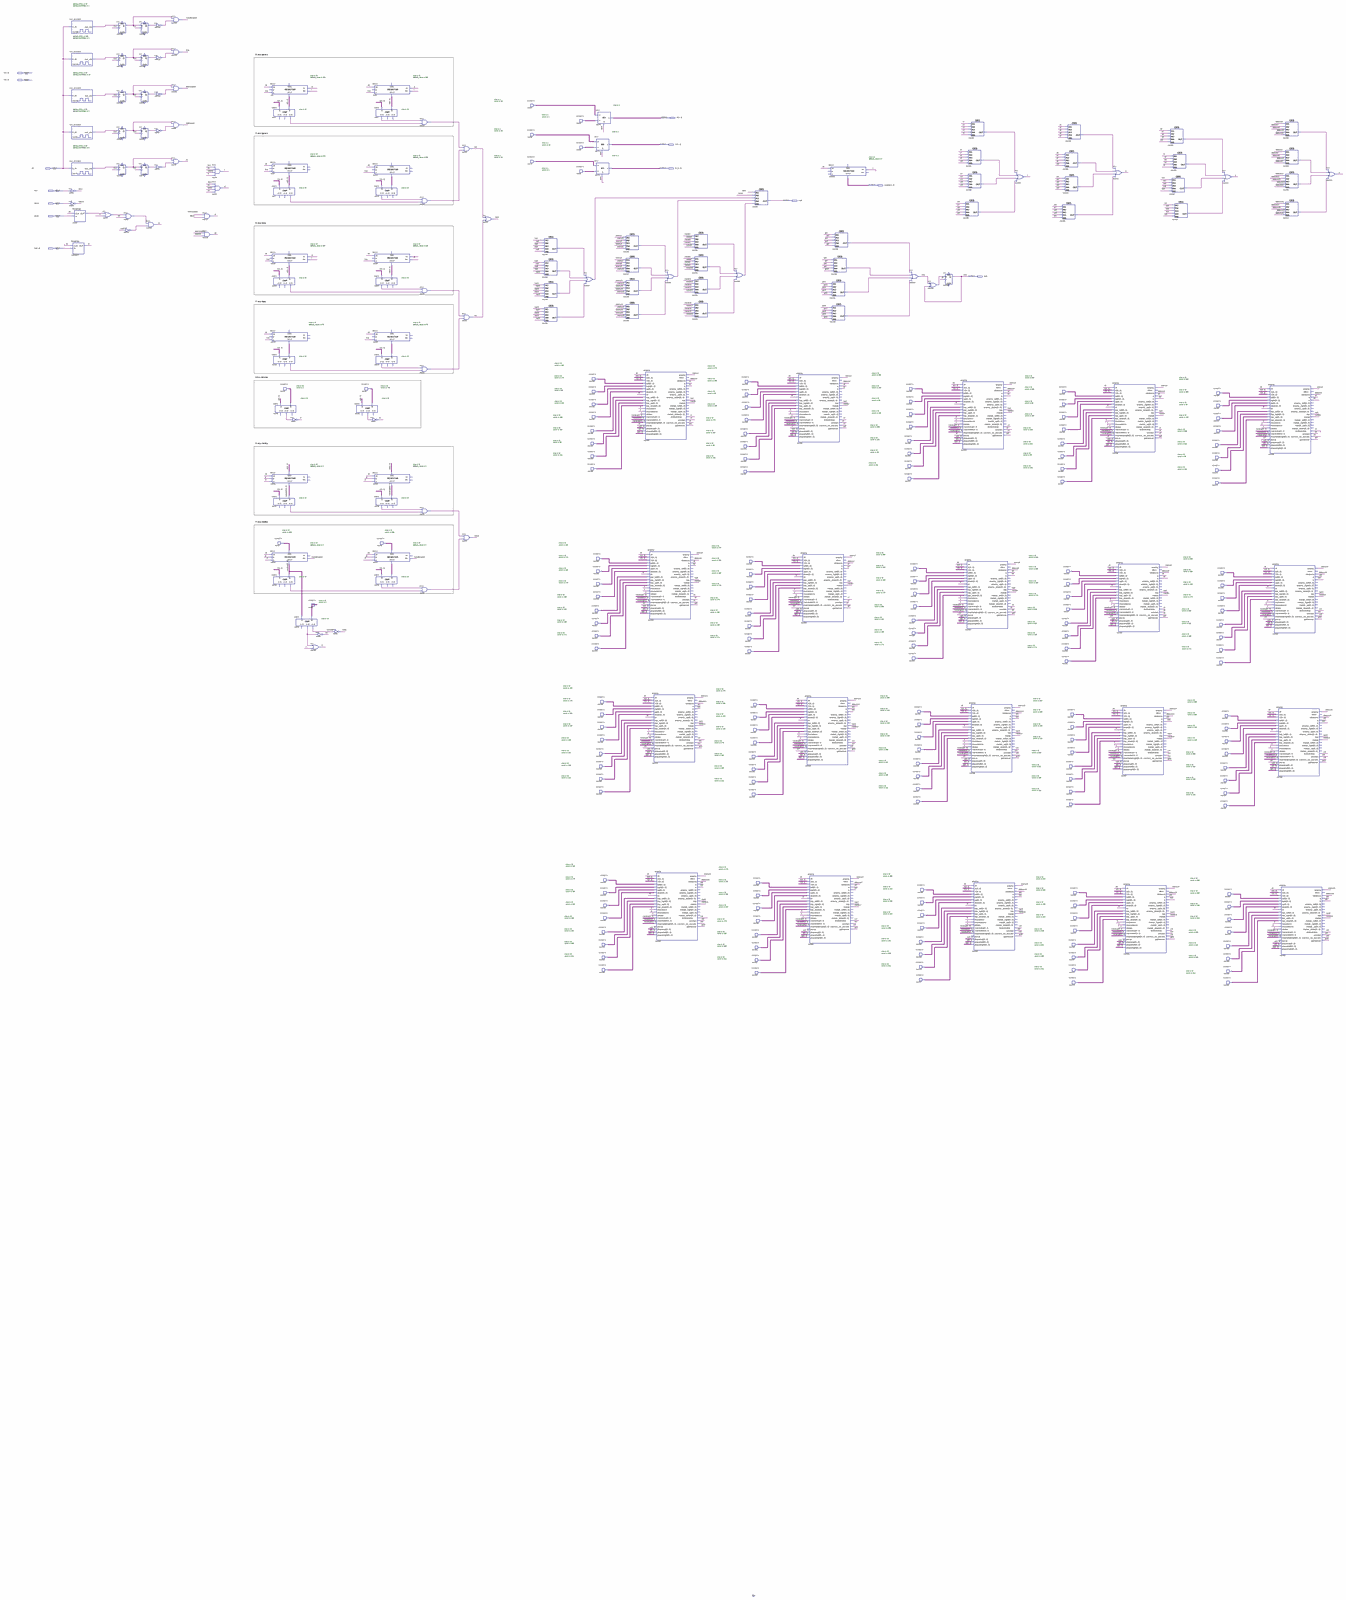
[diagram p0: schematic sheet, whole]
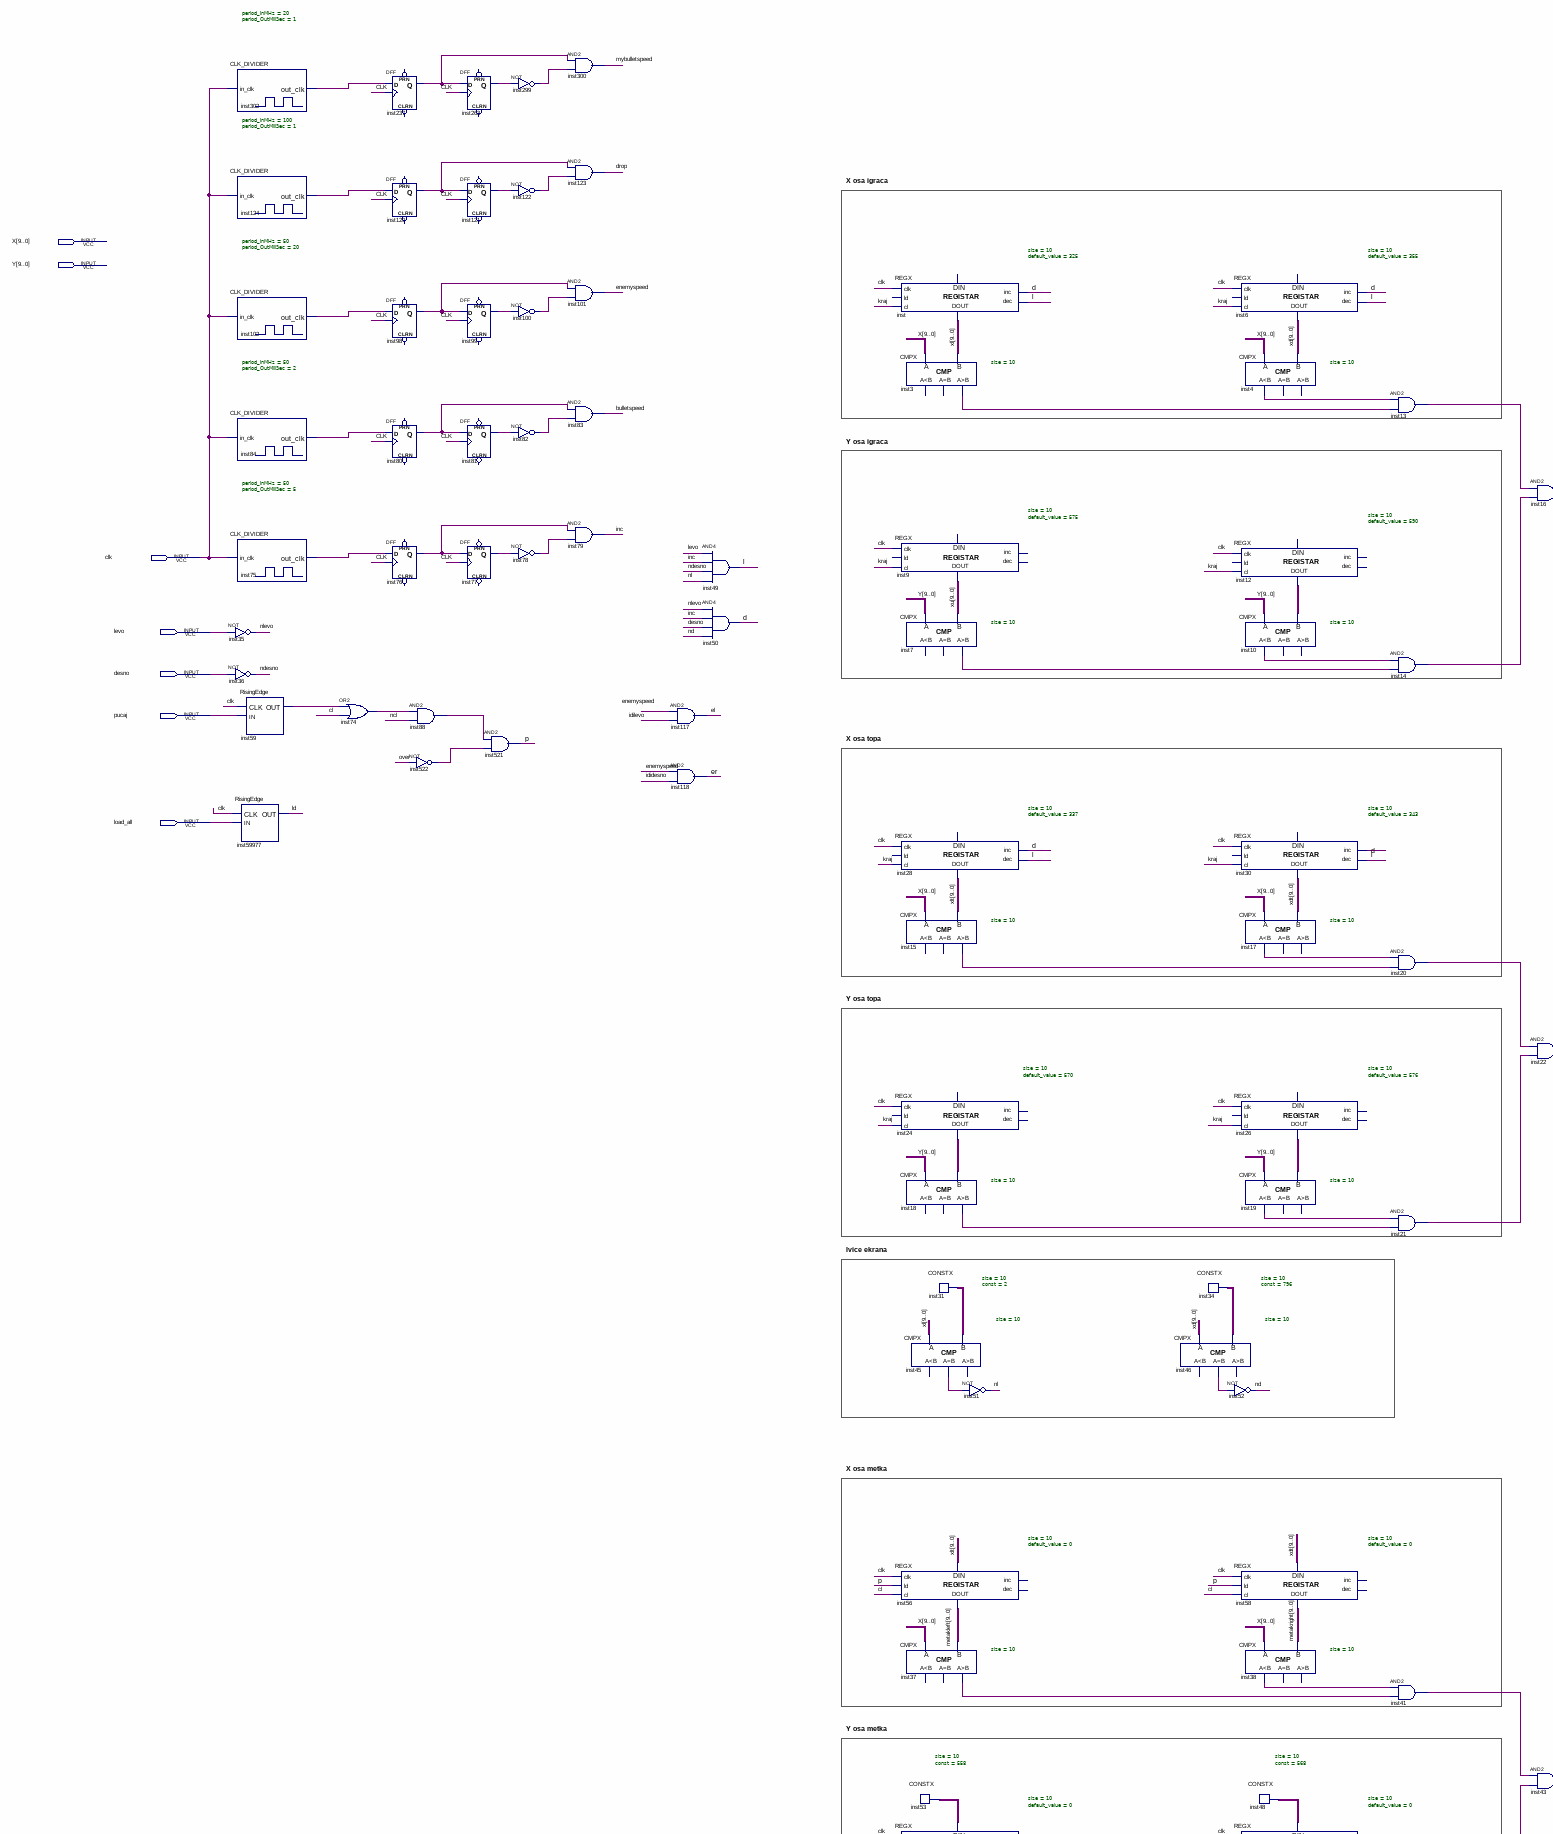
[diagram p1: schematic sheet, upper left part]
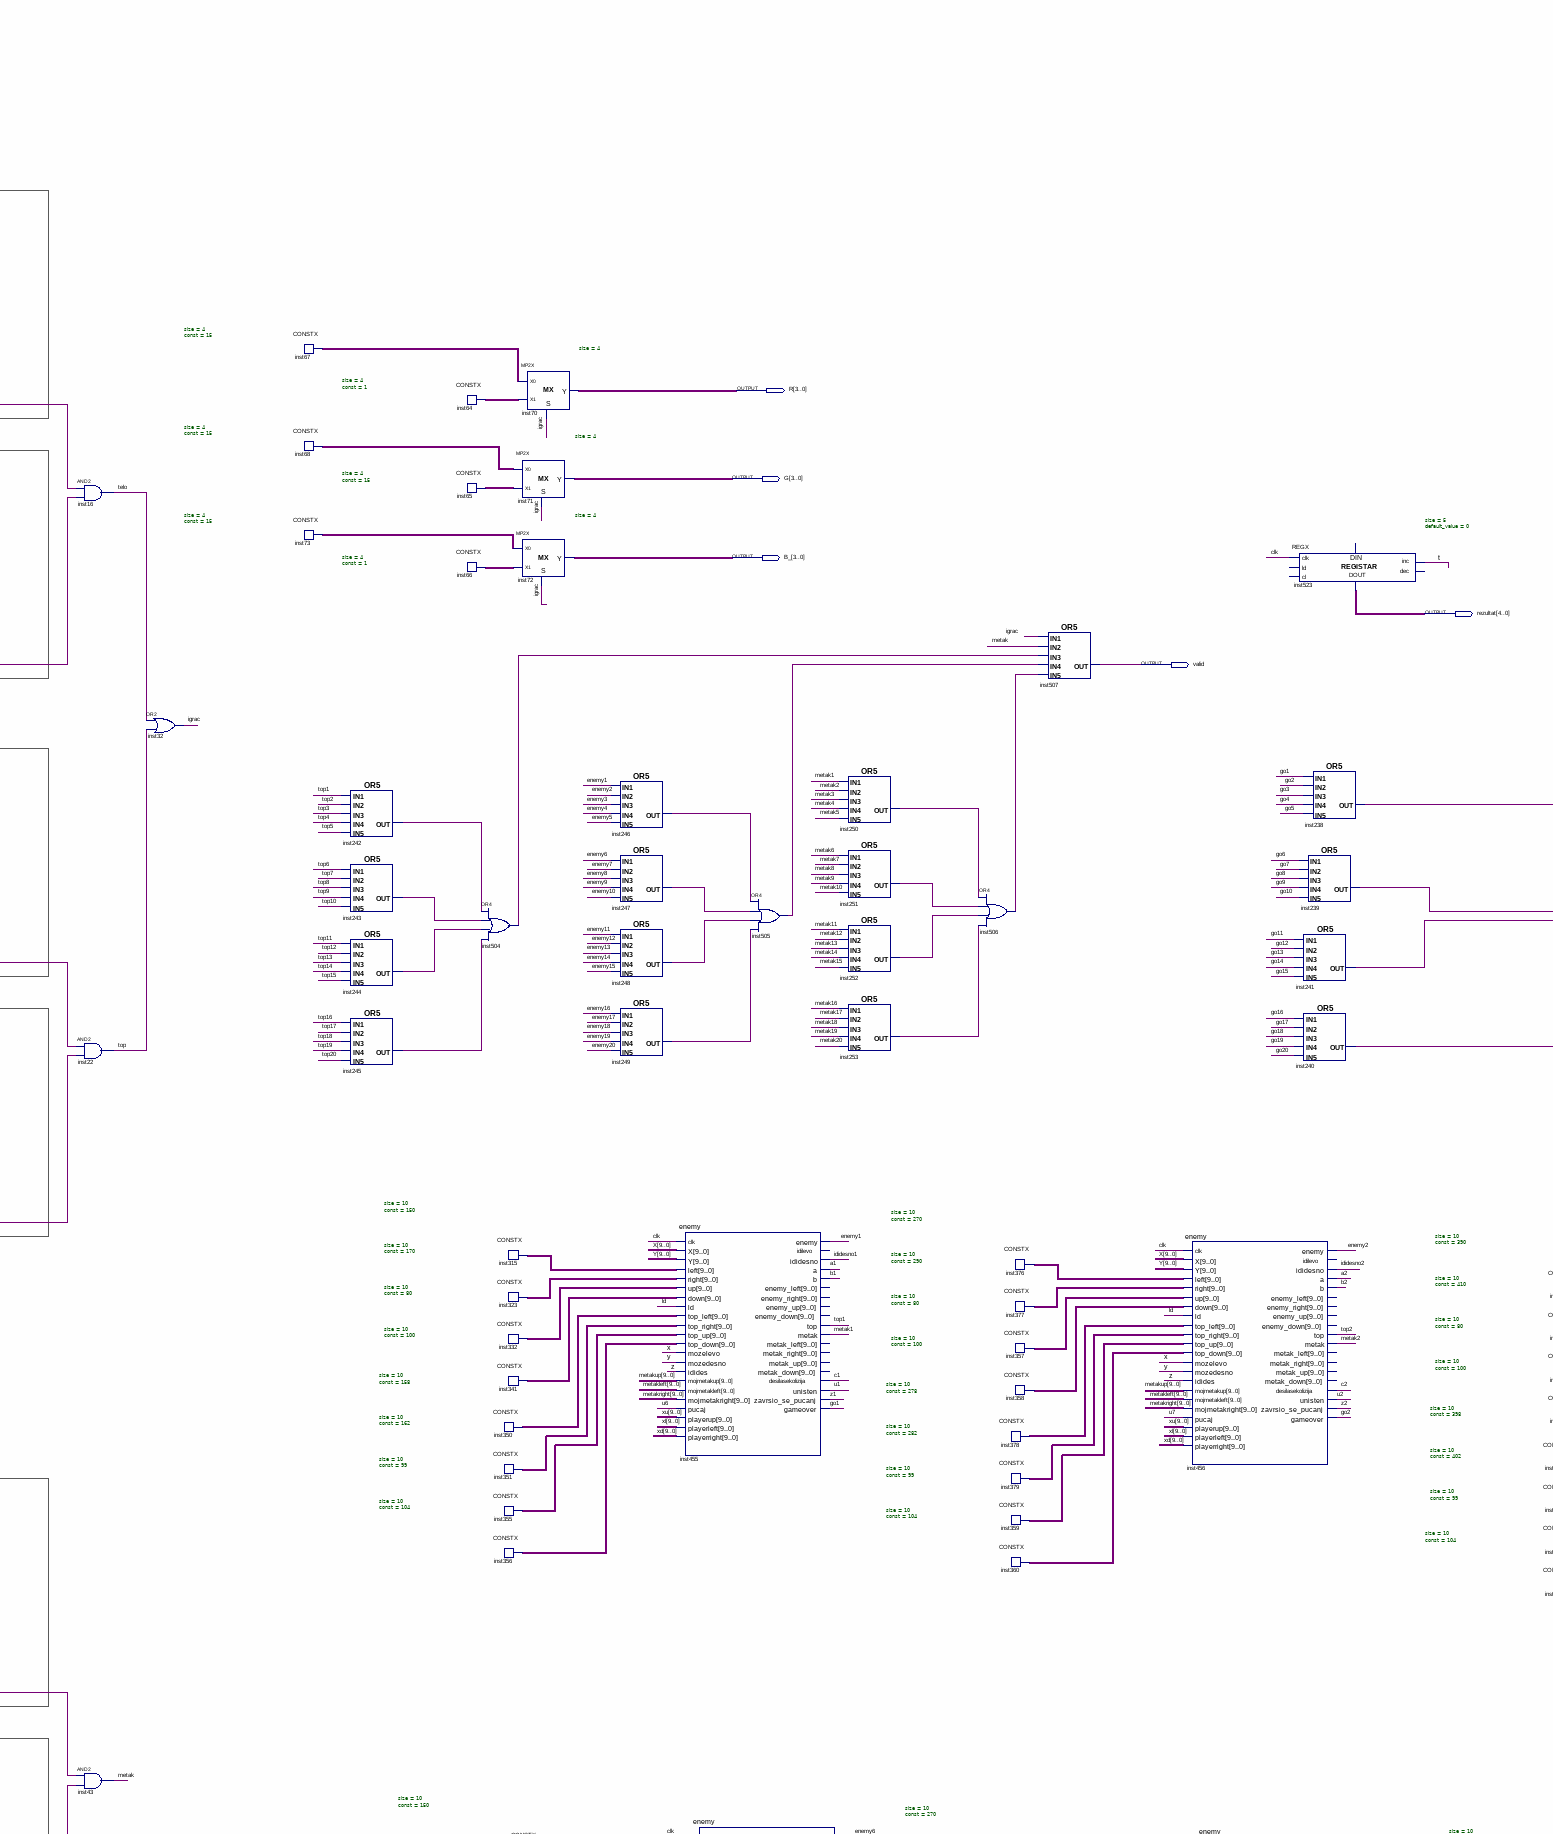
[diagram p2: schematic sheet, upper centre part]
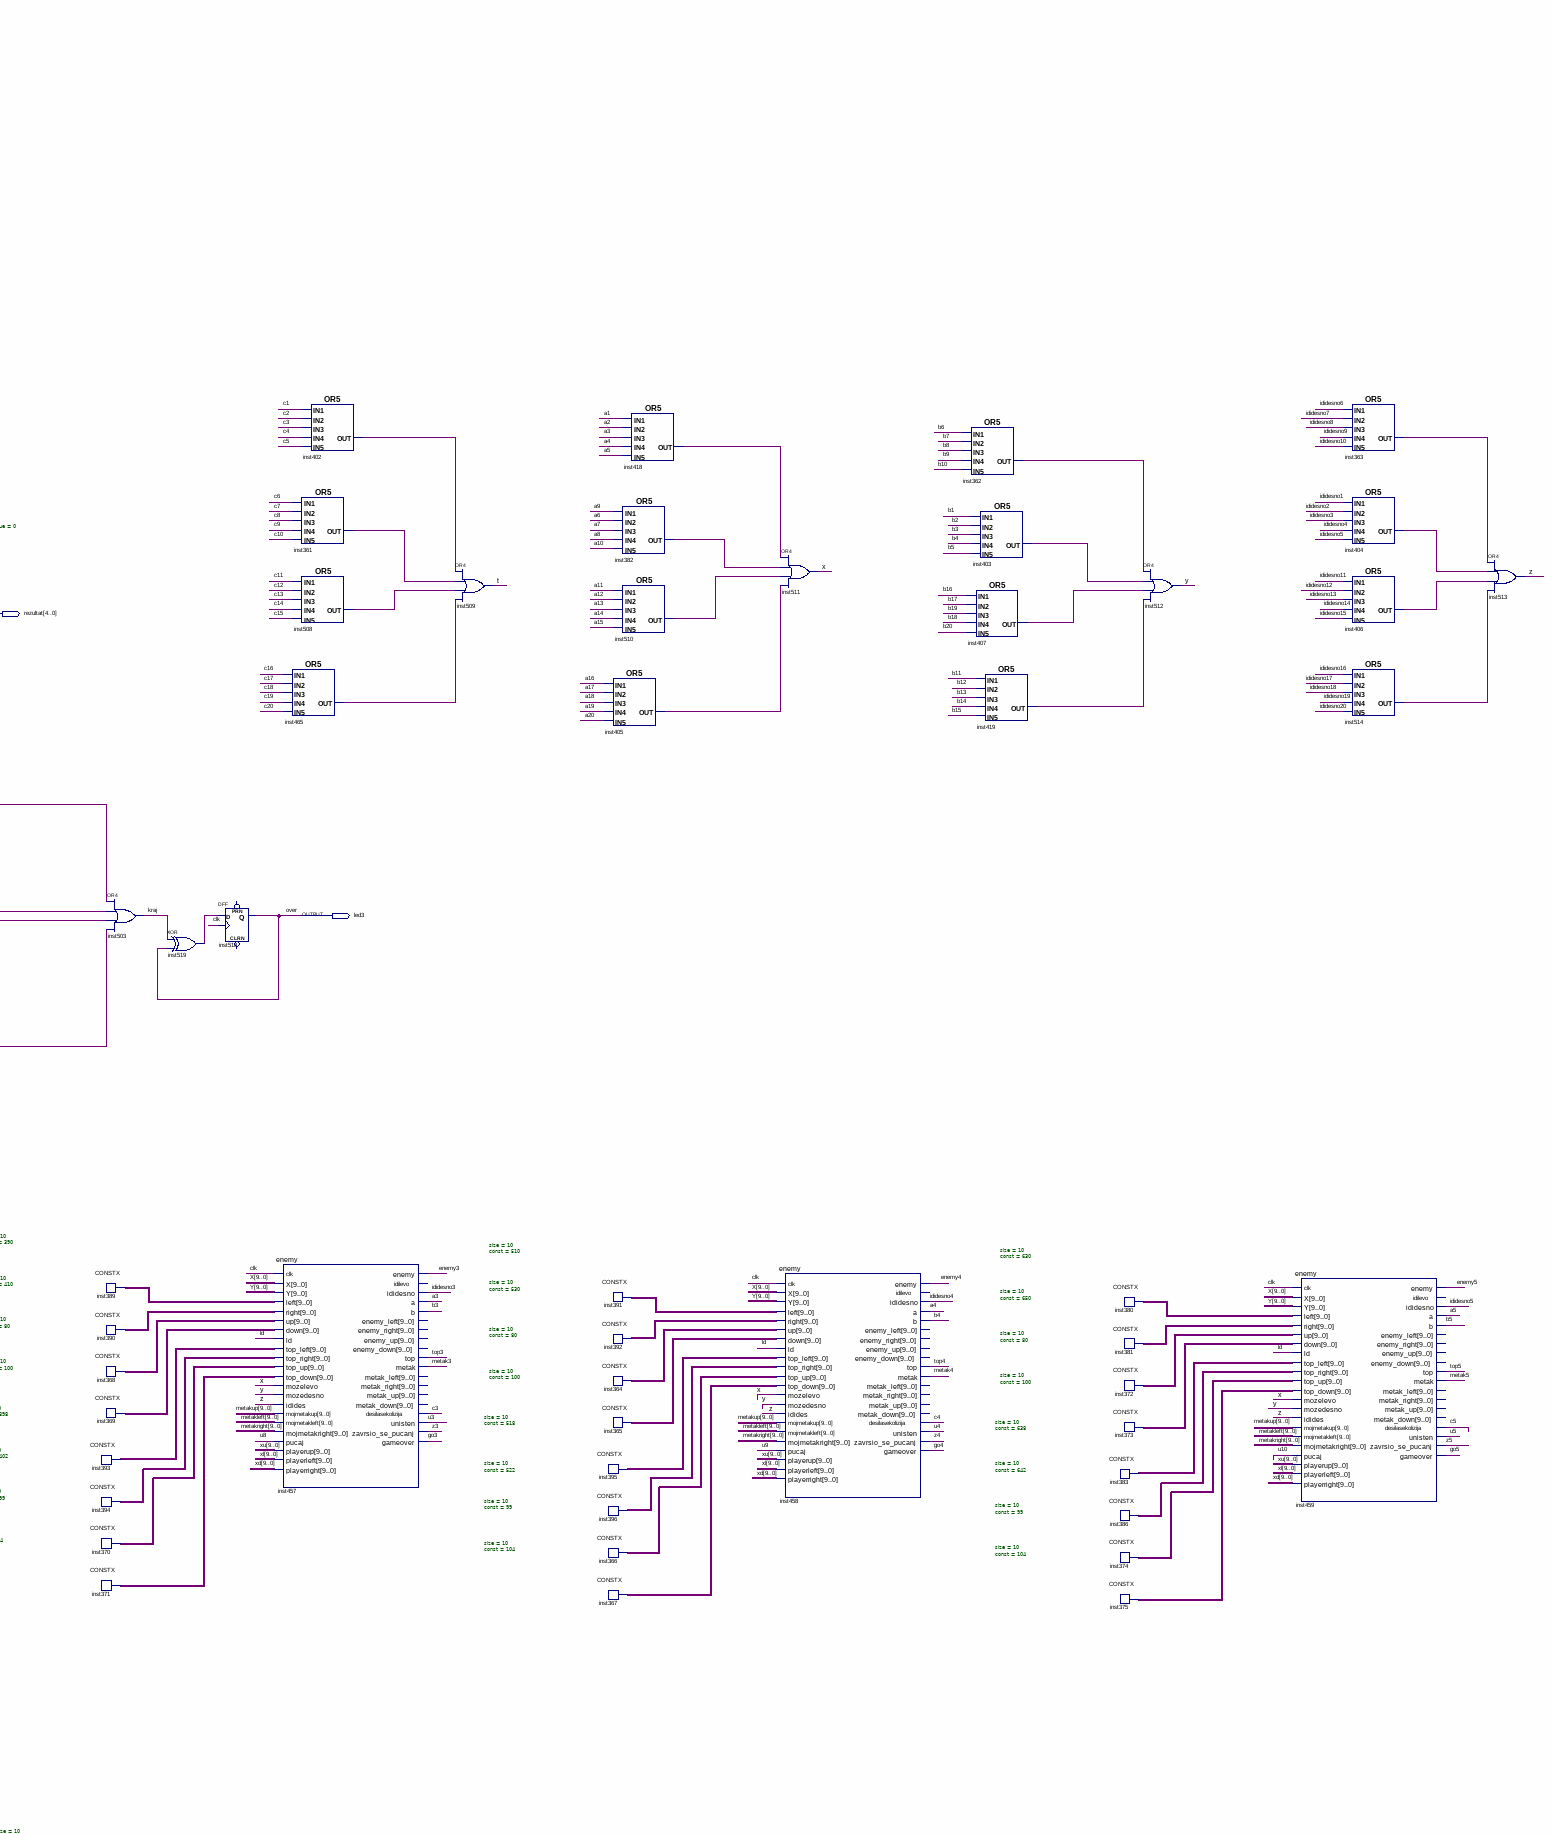
[diagram p3: schematic sheet, upper right part]
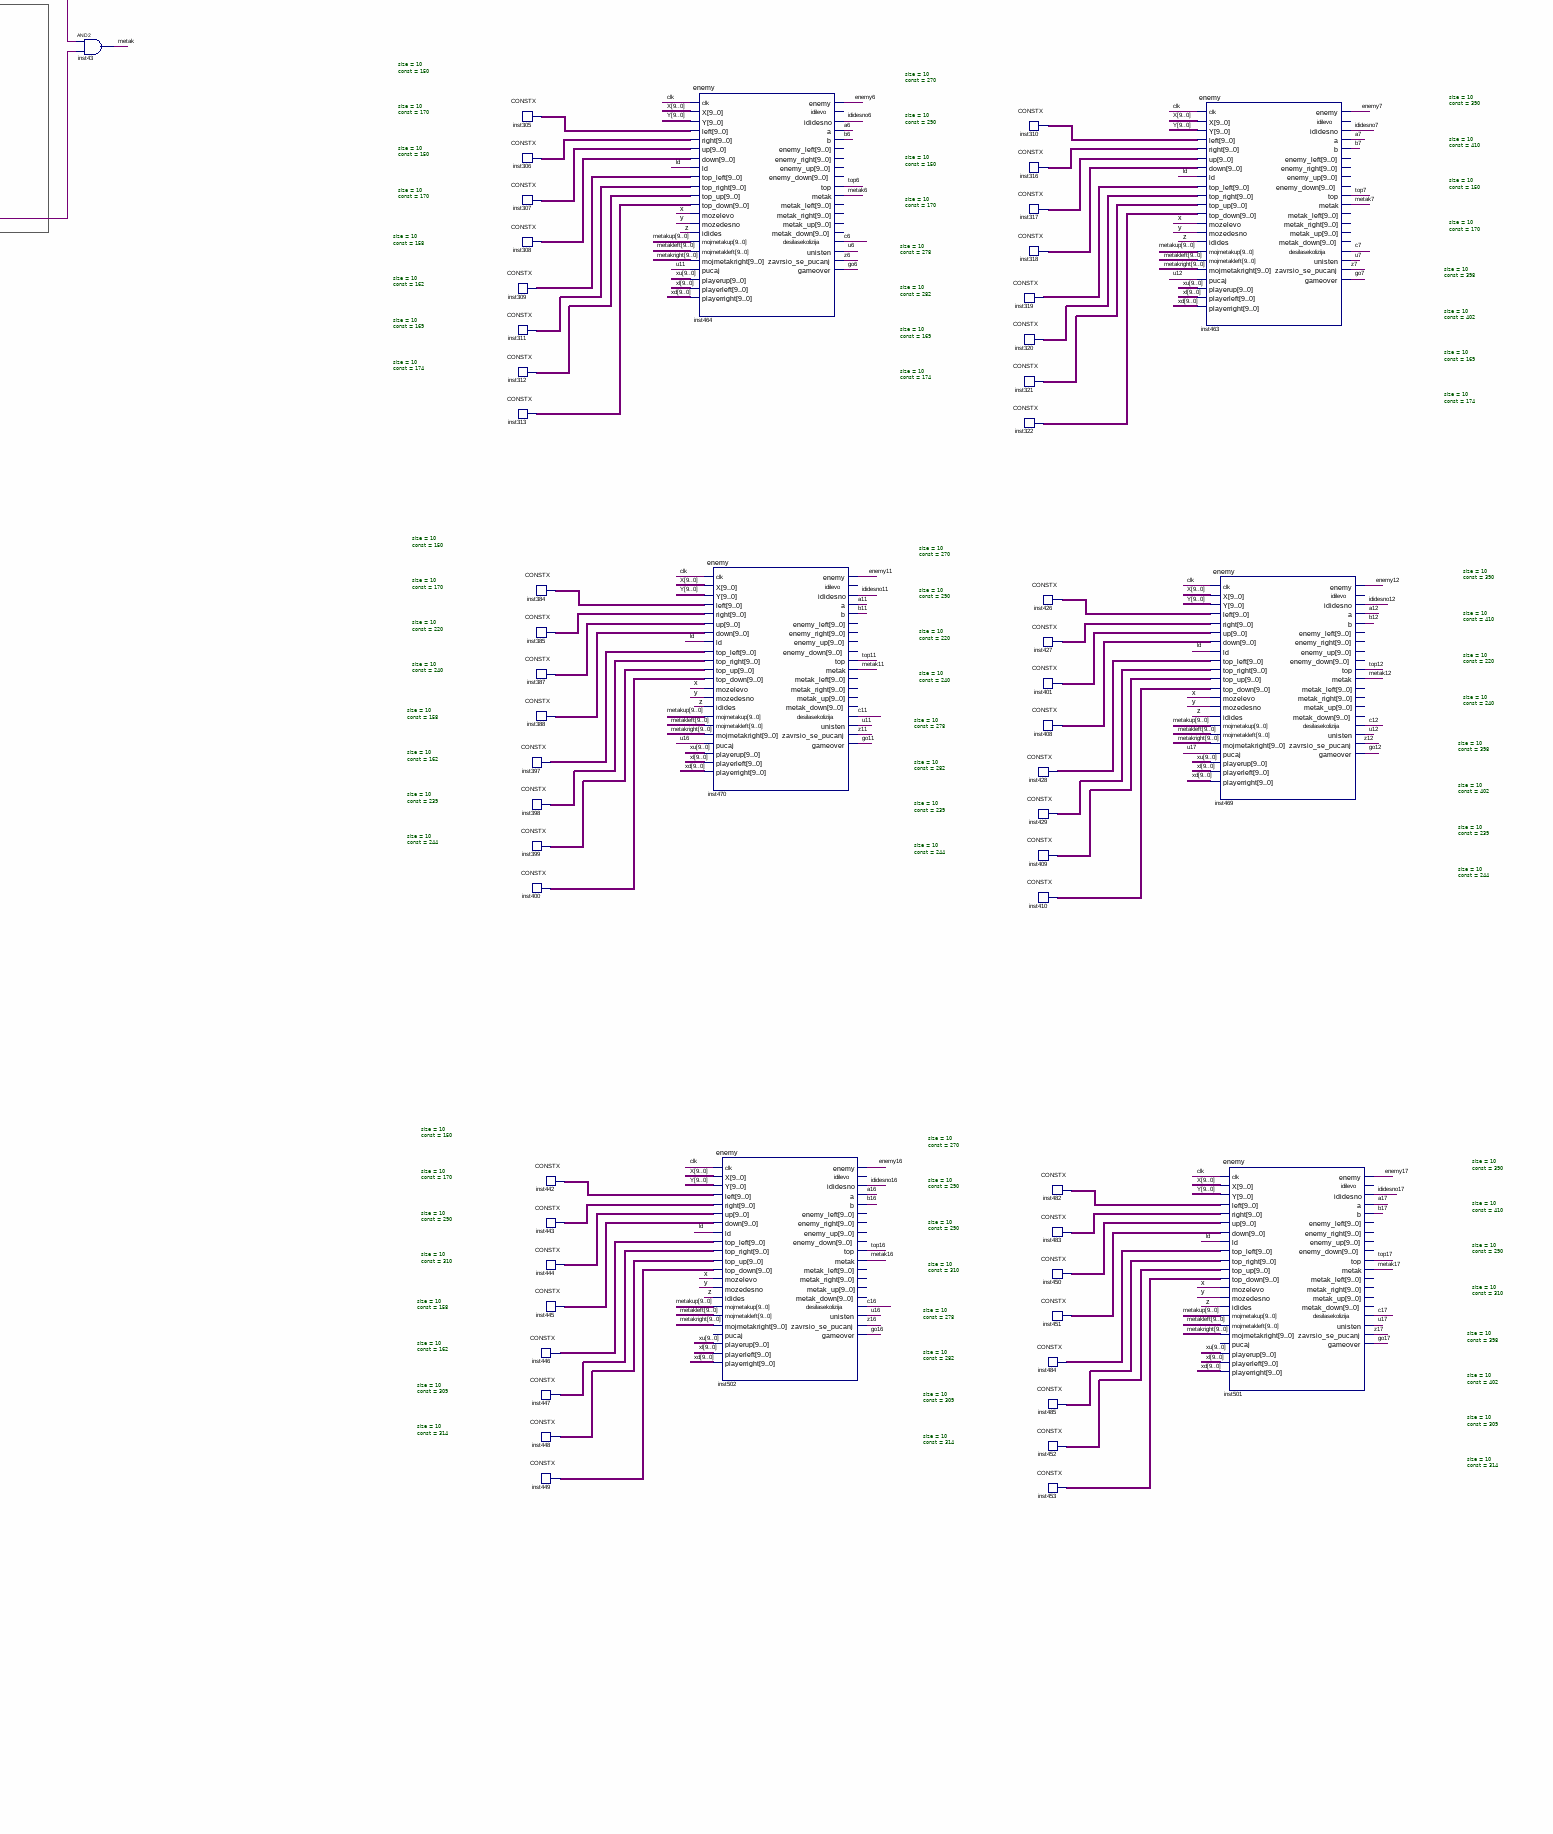
[diagram p4: schematic sheet, middle centre part]
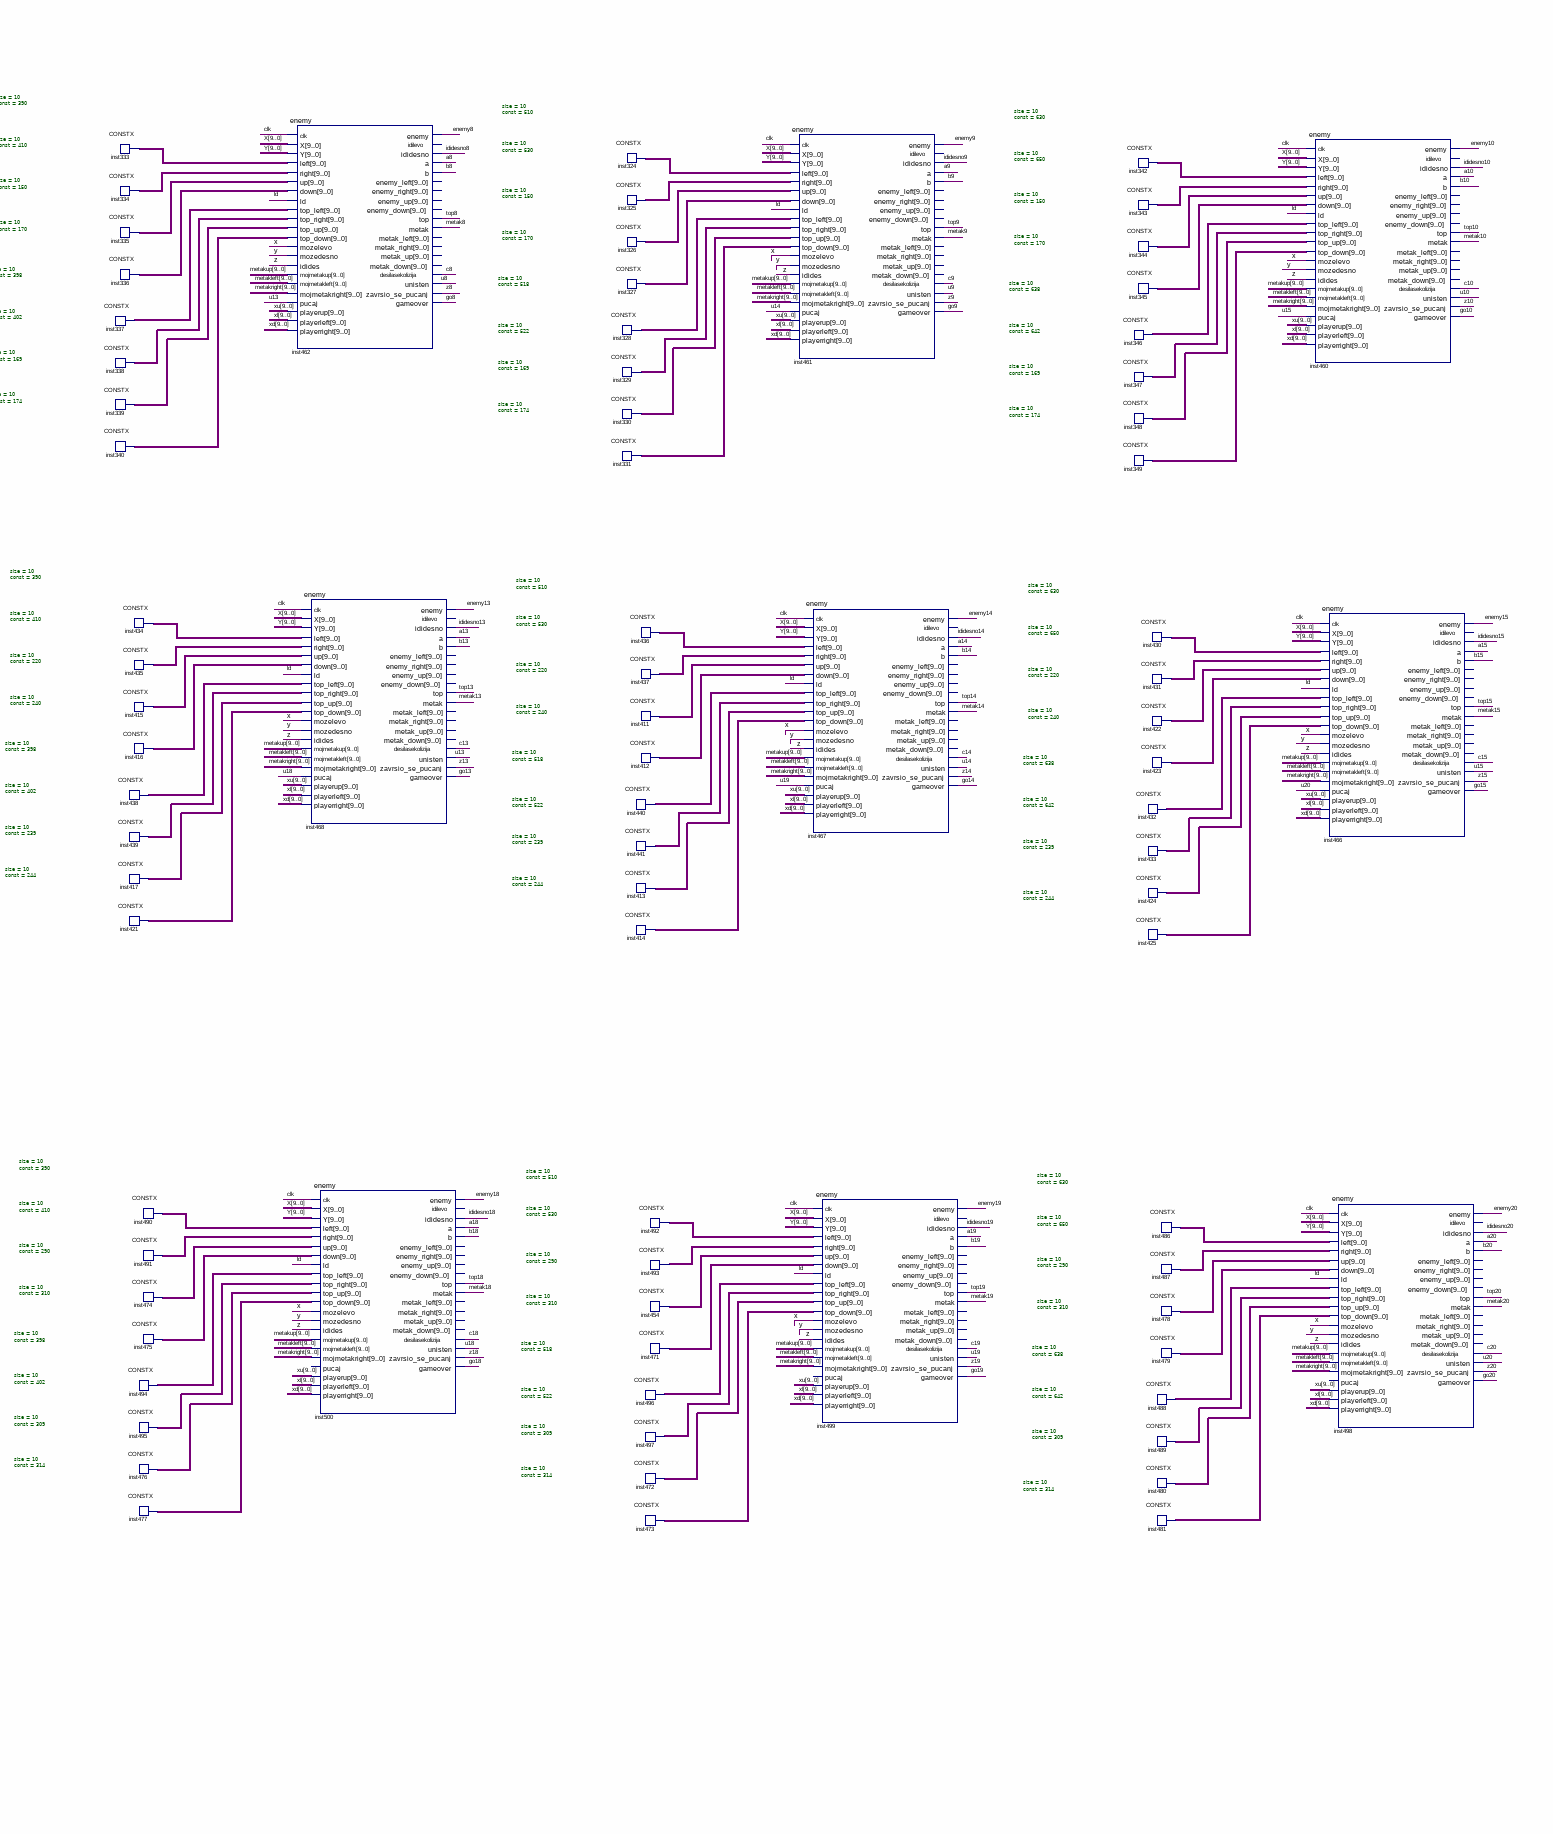
[diagram p5: schematic sheet, middle right part]
// Quartus schematic layer1.bdf as structural Verilog: 317 symbols, 13 pins
module layer1 (
  input  [9:0] X,
  input  [9:0] Y,
  input  clk,
  input  levo,
  input  desno,
  input  pucaj,
  input  load_all,
  output [3:0] R,
  output [3:0] G,
  output [3:0] B_,
  output [4:0] rezultat,
  output valid,
  output led3
);

  wire a1, a2, a3, a4, a5, a6, a7, a8, a9, a10, a11, a12, a13, a14, a15, a16, a17, a18, a19, a20, b1, b2, b3,
       b4, b5, b6, b7, b8, b9, b10, b11, b12, b13, b14, b15, b16, b17, b18, b19, b20, bulletspeed, c1, c2,
       c3, c4, c5, c6, c7, c8, c9, c10, c11, c12, c13, c14, c15, c16, c17, c18, c19, c20, cl, d, drop, el,
       enemy1, enemy2, enemy3, enemy4, enemy5, enemy6, enemy7, enemy8, enemy9, enemy10, enemy11, enemy12,
       enemy13, enemy14, enemy15, enemy16, enemy17, enemy18, enemy19, enemy20, enemyspeed, er, go1, go2, go3,
       go4, go5, go6, go7, go8, go9, go10, go11, go12, go13, go14, go15, go16, go17, go18, go19, go20,
       ididesno, ididesno1, ididesno2, ididesno3, ididesno4, ididesno5, ididesno6, ididesno7, ididesno8,
       ididesno9, ididesno10, ididesno11, ididesno12, ididesno13, ididesno14, ididesno15, ididesno16,
       ididesno17, ididesno18, ididesno19, ididesno20, idilevo, igrac, inc, inst3_gr, inst4_ls, inst7_gr,
       inst10_ls, inst13_out, inst14_out, inst15_gr, inst17_ls, inst18_gr, inst19_ls, inst20_out, inst21_out,
       inst37_gr, inst38_ls, inst39_gr, inst40_ls, inst41_out, inst42_out, inst45_eq, inst46_eq, inst55_eq,
       inst59_out, inst74_out, inst75_out_clk, inst76_q, inst77_q, inst78_out, inst80_q, inst81_q,
       inst82_out, inst84_out_clk, inst88_out, inst98_q, inst99_q, inst100_out, inst102_out_clk, inst120_q,
       inst121_q, inst122_out, inst124_out_clk, inst237_q, inst238_out, inst239_out, inst240_out,
       inst241_out, inst242_out, inst243_out, inst244_out, inst245_out, inst246_out, inst247_out,
       inst248_out, inst249_out, inst250_out, inst251_out, inst252_out, inst253_out, inst263_q, inst299_out,
       inst302_out_clk, inst361_out, inst362_out, inst363_out, inst382_out, inst402_out, inst403_out,
       inst404_out, inst405_out, inst406_out, inst407_out, inst418_out, inst419_out, inst465_out,
       inst504_out, inst505_out, inst506_out, inst508_out, inst510_out, inst514_out, inst519_out,
       inst522_out, kraj, l, ld, metak, metak1, metak2, metak3, metak4, metak5, metak6, metak7, metak8,
       metak9, metak10, metak11, metak12, metak13, metak14, metak15, metak16, metak17, metak18, metak19,
       metak20, mybulletspeed, ncl, nd, ndesno, nl, nlevo, notready, p, ready, t, telo, top, top1, top2,
       top3, top4, top5, top6, top7, top8, top9, top10, top11, top12, top13, top14, top15, top16, top17,
       top18, top19, top20, u1, u2, u3, u4, u5, u6, u7, u8, u9, u10, u11, u12, u13, u14, u15, u16, u17, u18,
       u19, u20, X_1bit, Y_1bit, z, z1, z2, z3, z4, z5, z6, z7, z8, z9, z10, z11, z12, z13, z14, z15, z16,
       z17, z18, z19, z20;
  wire [3:0] inst64_data, inst65_data, inst66_data, inst67_data, inst68_data, inst73_data;
  wire [9:0] inst12_data_out, inst24_data_out, inst26_data_out, inst31_data, inst34_data, inst47_data_out,
       inst48_data, inst53_data, inst60_data, inst305_data, inst306_data, inst307_data, inst308_data,
       inst309_data, inst310_data, inst311_data, inst312_data, inst313_data, inst315_data, inst316_data,
       inst317_data, inst318_data, inst319_data, inst320_data, inst321_data, inst322_data, inst323_data,
       inst324_data, inst325_data, inst326_data, inst327_data, inst328_data, inst329_data, inst330_data,
       inst331_data, inst332_data, inst333_data, inst334_data, inst335_data, inst336_data, inst337_data,
       inst338_data, inst339_data, inst340_data, inst341_data, inst342_data, inst343_data, inst344_data,
       inst345_data, inst346_data, inst347_data, inst348_data, inst349_data, inst350_data, inst351_data,
       inst355_data, inst356_data, inst357_data, inst358_data, inst359_data, inst360_data, inst364_data,
       inst365_data, inst366_data, inst367_data, inst368_data, inst369_data, inst370_data, inst371_data,
       inst372_data, inst373_data, inst374_data, inst375_data, inst376_data, inst377_data, inst378_data,
       inst379_data, inst380_data, inst381_data, inst383_data, inst384_data, inst385_data, inst386_data,
       inst387_data, inst388_data, inst389_data, inst390_data, inst391_data, inst392_data, inst393_data,
       inst394_data, inst395_data, inst396_data, inst397_data, inst398_data, inst399_data, inst400_data,
       inst401_data, inst408_data, inst409_data, inst410_data, inst411_data, inst412_data, inst413_data,
       inst414_data, inst415_data, inst416_data, inst417_data, inst421_data, inst422_data, inst423_data,
       inst424_data, inst425_data, inst426_data, inst427_data, inst428_data, inst429_data, inst430_data,
       inst431_data, inst432_data, inst433_data, inst434_data, inst435_data, inst436_data, inst437_data,
       inst438_data, inst439_data, inst440_data, inst441_data, inst442_data, inst443_data, inst444_data,
       inst445_data, inst446_data, inst447_data, inst448_data, inst449_data, inst450_data, inst451_data,
       inst452_data, inst453_data, inst454_data, inst471_data, inst472_data, inst473_data, inst474_data,
       inst475_data, inst476_data, inst477_data, inst478_data, inst479_data, inst480_data, inst481_data,
       inst482_data, inst483_data, inst484_data, inst485_data, inst486_data, inst487_data, inst488_data,
       inst489_data, inst490_data, inst491_data, inst492_data, inst493_data, inst494_data, inst495_data,
       inst496_data, inst497_data, metakleft, metakright, metakup, xd, xdt, xl, xlt, xu;

  CLK_DIVIDER #(.period_InMHz(20), .period_OutMiliSec(1)) inst302 (.in_clk(clk), .out_clk(inst302_out_clk));
  CLK_DIVIDER #(.period_InMHz(100), .period_OutMiliSec(1)) inst124 (.in_clk(clk), .out_clk(inst124_out_clk));
  CLK_DIVIDER #(.period_InMHz(50), .period_OutMiliSec(20)) inst102 (.in_clk(clk), .out_clk(inst102_out_clk));
  CLK_DIVIDER #(.period_InMHz(50), .period_OutMiliSec(2)) inst84 (.in_clk(clk), .out_clk(inst84_out_clk));
  CLK_DIVIDER #(.period_InMHz(50), .period_OutMiliSec(5)) inst75 (.in_clk(clk), .out_clk(inst75_out_clk));
  not inst35 (nlevo, levo);
  not inst36 (ndesno, desno);
  RisingEdge inst59 (.CLK(clk), .IN(pucaj), .OUT(inst59_out));
  RisingEdge inst59977 (.CLK(clk), .IN(load_all), .OUT(ld));
  or inst74 (inst74_out, inst59_out, cl);
  DFF inst237 (.CLK(clk), .D(inst302_out_clk), .Q(inst237_q));  // open: CLRN, PRN
  DFF inst120 (.CLK(clk), .D(inst124_out_clk), .Q(inst120_q));  // open: CLRN, PRN
  DFF inst98 (.CLK(clk), .D(inst102_out_clk), .Q(inst98_q));  // open: CLRN, PRN
  DFF inst80 (.CLK(clk), .D(inst84_out_clk), .Q(inst80_q));  // open: CLRN, PRN
  DFF inst76 (.CLK(clk), .D(inst75_out_clk), .Q(inst76_q));  // open: CLRN, PRN
  and inst88 (inst88_out, inst74_out, ncl);
  not inst522 (inst522_out, led3);
  DFF inst263 (.CLK(clk), .D(inst237_q), .Q(inst263_q));  // open: CLRN, PRN
  DFF inst121 (.CLK(clk), .D(inst120_q), .Q(inst121_q));  // open: CLRN, PRN
  DFF inst99 (.CLK(clk), .D(inst98_q), .Q(inst99_q));  // open: CLRN, PRN
  DFF inst81 (.CLK(clk), .D(inst80_q), .Q(inst81_q));  // open: CLRN, PRN
  DFF inst77 (.CLK(clk), .D(inst76_q), .Q(inst77_q));  // open: CLRN, PRN
  not inst299 (inst299_out, inst263_q);
  not inst122 (inst122_out, inst121_q);
  not inst100 (inst100_out, inst99_q);
  not inst82 (inst82_out, inst81_q);
  not inst78 (inst78_out, inst77_q);
  and inst521 (p, inst88_out, inst522_out);
  and inst300 (mybulletspeed, inst237_q, inst299_out);
  and inst123 (drop, inst120_q, inst122_out);
  and inst101 (enemyspeed, inst98_q, inst100_out);
  and inst83 (bulletspeed, inst80_q, inst82_out);
  and inst79 (inc, inst76_q, inst78_out);
  and inst49 (l, levo, inc, ndesno, nl);
  and inst50 (d, nlevo, inc, desno, nd);
  and inst117 (el, enemyspeed, idilevo);
  and inst118 (er, enemyspeed, ididesno);
  REGX #(.size(10), .default_value(325)) inst (
    .clk(clk), .cl(kraj), .inc(d), .dec(l), .data_out(xl));  // open: ld, data_in
  CMPX #(.size(10)) inst3 (.A(X), .B(xl), .gr(inst3_gr));  // open: ls, eq
  REGX #(.size(10), .default_value(575)) inst9 (.clk(clk), .cl(kraj), .data_out(xu));  // open: ld, inc, dec, data_in
  CMPX #(.size(10)) inst7 (.A(Y), .B(xu), .gr(inst7_gr));  // open: ls, eq
  REGX #(.size(10), .default_value(337)) inst28 (
    .clk(clk), .cl(kraj), .inc(d), .dec(l), .data_out(xlt));  // open: ld, data_in
  CMPX #(.size(10)) inst15 (.A(X), .B(xlt), .gr(inst15_gr));  // open: ls, eq
  REGX #(.size(10), .default_value(570)) inst24 (
    .clk(clk), .cl(kraj), .data_out(inst24_data_out));  // open: ld, inc, dec, data_in
  CMPX #(.size(10)) inst18 (.A(Y), .B(inst24_data_out), .gr(inst18_gr));  // open: ls, eq
  CONSTX #(.size(10), .\const (2)) inst31 (.data(inst31_data));
  CMPX #(.size(10)) inst45 (.A(xl), .B(inst31_data), .eq(inst45_eq));  // open: ls, gr
  REGX #(.size(10), .default_value(0)) inst56 (
    .clk(clk), .ld(p), .cl(cl), .data_in(xlt), .data_out(metakleft));  // open: inc, dec
  CMPX #(.size(10)) inst37 (.A(X), .B(metakleft), .gr(inst37_gr));  // open: ls, eq
  CONSTX #(.size(10), .\const (558)) inst53 (.data(inst53_data));
  REGX #(.size(10), .default_value(0)) inst54 (
    .clk(clk), .ld(p), .cl(cl), .dec(mybulletspeed), .data_in(inst53_data), .data_out(metakup));  // open: inc
  CMPX #(.size(10)) inst39 (.A(Y), .B(metakup), .gr(inst39_gr));  // open: ls, eq
  not inst51 (nl, inst45_eq);
  CMPX #(.size(10)) inst55 (.A(metakup), .B(inst60_data), .eq(inst55_eq), .gr(notready));  // open: ls
  CONSTX #(.size(10), .\const (2)) inst60 (.data(inst60_data));
  or inst420 (cl, inst55_eq, t);
  not inst86 (ncl, inst55_eq);
  not inst85 (ready, notready);
  CMPX #(.size(10)) inst46 (.A(xd), .B(inst34_data), .eq(inst46_eq));  // open: ls, gr
  CONSTX #(.size(10), .\const (796)) inst34 (.data(inst34_data));
  REGX #(.size(10), .default_value(355)) inst6 (
    .clk(clk), .cl(kraj), .inc(d), .dec(l), .data_out(xd));  // open: ld, data_in
  CMPX #(.size(10)) inst4 (.A(X), .B(xd), .ls(inst4_ls));  // open: eq, gr
  REGX #(.size(10), .default_value(590)) inst12 (
    .clk(clk), .cl(kraj), .data_out(inst12_data_out));  // open: ld, inc, dec, data_in
  CMPX #(.size(10)) inst10 (.A(Y), .B(inst12_data_out), .ls(inst10_ls));  // open: eq, gr
  REGX #(.size(10), .default_value(343)) inst30 (
    .clk(clk), .cl(kraj), .inc(d), .dec(l), .data_out(xdt));  // open: ld, data_in
  CMPX #(.size(10)) inst17 (.A(X), .B(xdt), .ls(inst17_ls));  // open: eq, gr
  REGX #(.size(10), .default_value(576)) inst26 (
    .clk(clk), .cl(kraj), .data_out(inst26_data_out));  // open: ld, inc, dec, data_in
  CMPX #(.size(10)) inst19 (.A(Y), .B(inst26_data_out), .ls(inst19_ls));  // open: eq, gr
  not inst52 (nd, inst46_eq);
  REGX #(.size(10), .default_value(0)) inst58 (
    .clk(clk), .ld(p), .cl(cl), .data_in(xdt), .data_out(metakright));  // open: inc, dec
  CMPX #(.size(10)) inst38 (.A(X), .B(metakright), .ls(inst38_ls));  // open: eq, gr
  CONSTX #(.size(10), .\const (568)) inst48 (.data(inst48_data));
  REGX #(.size(10), .default_value(0)) inst47 (
    .clk(clk), .ld(p), .cl(cl), .dec(mybulletspeed), .data_in(inst48_data), .data_out(inst47_data_out));  // open: inc
  CMPX #(.size(10)) inst40 (.A(Y), .B(inst47_data_out), .ls(inst40_ls));  // open: eq, gr
  and inst13 (inst13_out, inst4_ls, inst3_gr);
  and inst14 (inst14_out, inst10_ls, inst7_gr);
  and inst20 (inst20_out, inst17_ls, inst15_gr);
  and inst21 (inst21_out, inst19_ls, inst18_gr);
  and inst41 (inst41_out, inst38_ls, inst37_gr);
  and inst42 (inst42_out, inst40_ls, inst39_gr);
  and inst16 (telo, inst13_out, inst14_out);
  and inst22 (top, inst20_out, inst21_out);
  and inst43 (metak, inst41_out, inst42_out);
  or inst32 (igrac, telo, top);
  CONSTX #(.size(4), .\const (15)) inst67 (.data(inst67_data));
  CONSTX #(.size(4), .\const (15)) inst68 (.data(inst68_data));
  CONSTX #(.size(4), .\const (15)) inst73 (.data(inst73_data));
  or inst242 (inst242_out, top1, top2, top3, top4, top5);
  or inst243 (inst243_out, top6, top7, top8, top9, top10);
  or inst244 (inst244_out, top11, top12, top13, top14, top15);
  or inst245 (inst245_out, top16, top17, top18, top19, top20);
  CONSTX #(.size(4), .\const (1)) inst64 (.data(inst64_data));
  CONSTX #(.size(4), .\const (15)) inst65 (.data(inst65_data));
  CONSTX #(.size(4), .\const (1)) inst66 (.data(inst66_data));
  MP2X #(.size(4)) inst71 (.S(igrac), .X0(inst68_data), .X1(inst65_data), .Y(G));
  MP2X #(.size(4)) inst72 (.S(igrac), .X0(inst73_data), .X1(inst66_data), .Y(B_));
  or inst504 (inst504_out, inst242_out, inst243_out, inst244_out, inst245_out);
  CONSTX #(.size(10), .\const (150)) inst315 (.data(inst315_data));
  CONSTX #(.size(10), .\const (170)) inst323 (.data(inst323_data));
  CONSTX #(.size(10), .\const (80)) inst332 (.data(inst332_data));
  CONSTX #(.size(10), .\const (100)) inst341 (.data(inst341_data));
  CONSTX #(.size(10), .\const (158)) inst350 (.data(inst350_data));
  CONSTX #(.size(10), .\const (162)) inst351 (.data(inst351_data));
  CONSTX #(.size(10), .\const (99)) inst355 (.data(inst355_data));
  CONSTX #(.size(10), .\const (104)) inst356 (.data(inst356_data));
  CONSTX #(.size(10), .\const (150)) inst305 (.data(inst305_data));
  CONSTX #(.size(10), .\const (170)) inst306 (.data(inst306_data));
  CONSTX #(.size(10), .\const (150)) inst307 (.data(inst307_data));
  CONSTX #(.size(10), .\const (170)) inst308 (.data(inst308_data));
  CONSTX #(.size(10), .\const (158)) inst309 (.data(inst309_data));
  CONSTX #(.size(10), .\const (162)) inst311 (.data(inst311_data));
  CONSTX #(.size(10), .\const (169)) inst312 (.data(inst312_data));
  CONSTX #(.size(10), .\const (174)) inst313 (.data(inst313_data));
  MP2X #(.size(4)) inst70 (.S(igrac), .X0(inst67_data), .X1(inst64_data), .Y(R));
  CONSTX #(.size(10), .\const (150)) inst384 (.data(inst384_data));
  CONSTX #(.size(10), .\const (170)) inst385 (.data(inst385_data));
  CONSTX #(.size(10), .\const (220)) inst387 (.data(inst387_data));
  CONSTX #(.size(10), .\const (240)) inst388 (.data(inst388_data));
  CONSTX #(.size(10), .\const (158)) inst397 (.data(inst397_data));
  CONSTX #(.size(10), .\const (162)) inst398 (.data(inst398_data));
  CONSTX #(.size(10), .\const (239)) inst399 (.data(inst399_data));
  CONSTX #(.size(10), .\const (244)) inst400 (.data(inst400_data));
  CONSTX #(.size(10), .\const (150)) inst442 (.data(inst442_data));
  CONSTX #(.size(10), .\const (170)) inst443 (.data(inst443_data));
  CONSTX #(.size(10), .\const (290)) inst444 (.data(inst444_data));
  CONSTX #(.size(10), .\const (310)) inst445 (.data(inst445_data));
  CONSTX #(.size(10), .\const (158)) inst446 (.data(inst446_data));
  CONSTX #(.size(10), .\const (162)) inst447 (.data(inst447_data));
  CONSTX #(.size(10), .\const (309)) inst448 (.data(inst448_data));
  CONSTX #(.size(10), .\const (314)) inst449 (.data(inst449_data));
  or inst246 (inst246_out, enemy1, enemy2, enemy3, enemy4, enemy5);
  or inst247 (inst247_out, enemy6, enemy7, enemy8, enemy9, enemy10);
  or inst248 (inst248_out, enemy11, enemy12, enemy13, enemy14, enemy15);
  or inst249 (inst249_out, enemy16, enemy17, enemy18, enemy19, enemy20);
  enemy inst455 (
    .clk(clk), .X(X), .Y(Y), .left(inst315_data), .right(inst323_data), .up(inst332_data),
    .down(inst341_data), .ld(ld), .top_left(inst350_data), .top_right(inst351_data), .top_up(inst355_data),
    .top_down(inst356_data), .mozelevo(X_1bit), .mozedesno(Y_1bit), .idides(z), .mojmetakup(metakup),
    .mojmetakleft(metakleft), .mojmetakright(metakright), .pucaj(u6), .playerup(xu), .playerleft(xl),
    .playerright(xd), .enemy(enemy1), .ididesno(ididesno1), .a(a1), .b(b1), .top(top1), .metak(metak1),
    .desilasekolizija(c1), .unisten(u1), .zavrsio_se_pucanj(z1), .gameover(go1));  // open: idilevo, enemy_left, enemy_right, enemy_up, enemy_down, metak_left, metak_right, metak_up, metak_down
  enemy inst464 (
    .clk(clk), .X(X), .Y(Y), .left(inst305_data), .right(inst306_data), .up(inst307_data),
    .down(inst308_data), .ld(ld), .top_left(inst309_data), .top_right(inst311_data), .top_up(inst312_data),
    .top_down(inst313_data), .mozelevo(X_1bit), .mozedesno(Y_1bit), .idides(z), .mojmetakup(metakup),
    .mojmetakleft(metakleft), .mojmetakright(metakright), .pucaj(u11), .playerup(xu), .playerleft(xl),
    .playerright(xd), .enemy(enemy6), .ididesno(ididesno6), .a(a6), .b(b6), .top(top6), .metak(metak6),
    .desilasekolizija(c6), .unisten(u6), .zavrsio_se_pucanj(z6), .gameover(go6));  // open: idilevo, enemy_left, enemy_right, enemy_up, enemy_down, metak_left, metak_right, metak_up, metak_down
  enemy inst470 (
    .clk(clk), .X(X), .Y(Y), .left(inst384_data), .right(inst385_data), .up(inst387_data),
    .down(inst388_data), .ld(ld), .top_left(inst397_data), .top_right(inst398_data), .top_up(inst399_data),
    .top_down(inst400_data), .mozelevo(X_1bit), .mozedesno(Y_1bit), .idides(z), .mojmetakup(metakup),
    .mojmetakleft(metakleft), .mojmetakright(metakright), .pucaj(u16), .playerup(xu), .playerleft(xl),
    .playerright(xd), .enemy(enemy11), .ididesno(ididesno11), .a(a11), .b(b11), .top(top11), .metak(metak11),
    .desilasekolizija(c11), .unisten(u11), .zavrsio_se_pucanj(z11), .gameover(go11));  // open: idilevo, enemy_left, enemy_right, enemy_up, enemy_down, metak_left, metak_right, metak_up, metak_down
  enemy inst502 (
    .clk(clk), .X(X), .Y(Y), .left(inst442_data), .right(inst443_data), .up(inst444_data),
    .down(inst445_data), .ld(ld), .top_left(inst446_data), .top_right(inst447_data), .top_up(inst448_data),
    .top_down(inst449_data), .mozelevo(X_1bit), .mozedesno(Y_1bit), .idides(z), .mojmetakup(metakup),
    .mojmetakleft(metakleft), .mojmetakright(metakright), .playerup(xu), .playerleft(xl), .playerright(xd),
    .enemy(enemy16), .ididesno(ididesno16), .a(a16), .b(b16), .top(top16), .metak(metak16),
    .desilasekolizija(c16), .unisten(u16), .zavrsio_se_pucanj(z16), .gameover(go16));  // open: pucaj, idilevo, enemy_left, enemy_right, enemy_up, enemy_down, metak_left, metak_right, metak_up, metak_down
  or inst505 (inst505_out, inst246_out, inst247_out, inst248_out, inst249_out);
  or inst250 (inst250_out, metak1, metak2, metak3, metak4, metak5);
  or inst251 (inst251_out, metak6, metak7, metak8, metak9, metak10);
  or inst252 (inst252_out, metak11, metak12, metak13, metak14, metak15);
  or inst253 (inst253_out, metak16, metak17, metak18, metak19, metak20);
  or inst506 (inst506_out, inst250_out, inst251_out, inst252_out, inst253_out);
  CONSTX #(.size(10), .\const (278)) inst378 (.data(inst378_data));
  CONSTX #(.size(10), .\const (282)) inst379 (.data(inst379_data));
  CONSTX #(.size(10), .\const (99)) inst359 (.data(inst359_data));
  CONSTX #(.size(10), .\const (104)) inst360 (.data(inst360_data));
  CONSTX #(.size(10), .\const (270)) inst376 (.data(inst376_data));
  CONSTX #(.size(10), .\const (290)) inst377 (.data(inst377_data));
  CONSTX #(.size(10), .\const (80)) inst357 (.data(inst357_data));
  CONSTX #(.size(10), .\const (100)) inst358 (.data(inst358_data));
  CONSTX #(.size(10), .\const (270)) inst310 (.data(inst310_data));
  CONSTX #(.size(10), .\const (290)) inst316 (.data(inst316_data));
  CONSTX #(.size(10), .\const (150)) inst317 (.data(inst317_data));
  CONSTX #(.size(10), .\const (170)) inst318 (.data(inst318_data));
  CONSTX #(.size(10), .\const (278)) inst319 (.data(inst319_data));
  CONSTX #(.size(10), .\const (282)) inst320 (.data(inst320_data));
  CONSTX #(.size(10), .\const (169)) inst321 (.data(inst321_data));
  CONSTX #(.size(10), .\const (174)) inst322 (.data(inst322_data));
  CONSTX #(.size(10), .\const (270)) inst426 (.data(inst426_data));
  CONSTX #(.size(10), .\const (290)) inst427 (.data(inst427_data));
  CONSTX #(.size(10), .\const (220)) inst401 (.data(inst401_data));
  CONSTX #(.size(10), .\const (240)) inst408 (.data(inst408_data));
  CONSTX #(.size(10), .\const (278)) inst428 (.data(inst428_data));
  CONSTX #(.size(10), .\const (282)) inst429 (.data(inst429_data));
  CONSTX #(.size(10), .\const (239)) inst409 (.data(inst409_data));
  CONSTX #(.size(10), .\const (244)) inst410 (.data(inst410_data));
  CONSTX #(.size(10), .\const (278)) inst484 (.data(inst484_data));
  CONSTX #(.size(10), .\const (282)) inst485 (.data(inst485_data));
  CONSTX #(.size(10), .\const (309)) inst452 (.data(inst452_data));
  CONSTX #(.size(10), .\const (314)) inst453 (.data(inst453_data));
  or inst507 (valid, igrac, metak, inst504_out, inst505_out, inst506_out);
  CONSTX #(.size(10), .\const (270)) inst482 (.data(inst482_data));
  CONSTX #(.size(10), .\const (290)) inst483 (.data(inst483_data));
  CONSTX #(.size(10), .\const (290)) inst450 (.data(inst450_data));
  CONSTX #(.size(10), .\const (310)) inst451 (.data(inst451_data));
  enemy inst456 (
    .clk(clk), .X(X), .Y(Y), .left(inst376_data), .right(inst377_data), .up(inst357_data),
    .down(inst358_data), .ld(ld), .top_left(inst378_data), .top_right(inst379_data), .top_up(inst359_data),
    .top_down(inst360_data), .mozelevo(X_1bit), .mozedesno(Y_1bit), .idides(z), .mojmetakup(metakup),
    .mojmetakleft(metakleft), .mojmetakright(metakright), .pucaj(u7), .playerup(xu), .playerleft(xl),
    .playerright(xd), .enemy(enemy2), .ididesno(ididesno2), .a(a2), .b(b2), .top(top2), .metak(metak2),
    .desilasekolizija(c2), .unisten(u2), .zavrsio_se_pucanj(z2), .gameover(go2));  // open: idilevo, enemy_left, enemy_right, enemy_up, enemy_down, metak_left, metak_right, metak_up, metak_down
  enemy inst463 (
    .clk(clk), .X(X), .Y(Y), .left(inst310_data), .right(inst316_data), .up(inst317_data),
    .down(inst318_data), .ld(ld), .top_left(inst319_data), .top_right(inst320_data), .top_up(inst321_data),
    .top_down(inst322_data), .mozelevo(X_1bit), .mozedesno(Y_1bit), .idides(z), .mojmetakup(metakup),
    .mojmetakleft(metakleft), .mojmetakright(metakright), .pucaj(u12), .playerup(xu), .playerleft(xl),
    .playerright(xd), .enemy(enemy7), .ididesno(ididesno7), .a(a7), .b(b7), .top(top7), .metak(metak7),
    .desilasekolizija(c7), .unisten(u7), .zavrsio_se_pucanj(z7), .gameover(go7));  // open: idilevo, enemy_left, enemy_right, enemy_up, enemy_down, metak_left, metak_right, metak_up, metak_down
  enemy inst469 (
    .clk(clk), .X(X), .Y(Y), .left(inst426_data), .right(inst427_data), .up(inst401_data),
    .down(inst408_data), .ld(ld), .top_left(inst428_data), .top_right(inst429_data), .top_up(inst409_data),
    .top_down(inst410_data), .mozelevo(X_1bit), .mozedesno(Y_1bit), .idides(z), .mojmetakup(metakup),
    .mojmetakleft(metakleft), .mojmetakright(metakright), .pucaj(u17), .playerup(xu), .playerleft(xl),
    .playerright(xd), .enemy(enemy12), .ididesno(ididesno12), .a(a12), .b(b12), .top(top12), .metak(metak12),
    .desilasekolizija(c12), .unisten(u12), .zavrsio_se_pucanj(z12), .gameover(go12));  // open: idilevo, enemy_left, enemy_right, enemy_up, enemy_down, metak_left, metak_right, metak_up, metak_down
  enemy inst501 (
    .clk(clk), .X(X), .Y(Y), .left(inst482_data), .right(inst483_data), .up(inst450_data),
    .down(inst451_data), .ld(ld), .top_left(inst484_data), .top_right(inst485_data), .top_up(inst452_data),
    .top_down(inst453_data), .mozelevo(X_1bit), .mozedesno(Y_1bit), .idides(z), .mojmetakup(metakup),
    .mojmetakleft(metakleft), .mojmetakright(metakright), .playerup(xu), .playerleft(xl), .playerright(xd),
    .enemy(enemy17), .ididesno(ididesno17), .a(a17), .b(b17), .top(top17), .metak(metak17),
    .desilasekolizija(c17), .unisten(u17), .zavrsio_se_pucanj(z17), .gameover(go17));  // open: pucaj, idilevo, enemy_left, enemy_right, enemy_up, enemy_down, metak_left, metak_right, metak_up, metak_down
  REGX #(.size(5), .default_value(0)) inst523 (.clk(clk), .inc(t), .data_out(rezultat));  // open: ld, cl, dec, data_in
  or inst241 (inst241_out, go11, go12, go13, go14, go15);
  or inst240 (inst240_out, go16, go17, go18, go19, go20);
  or inst238 (inst238_out, go1, go2, go3, go4, go5);
  or inst239 (inst239_out, go6, go7, go8, go9, go10);
  CONSTX #(.size(10), .\const (390)) inst389 (.data(inst389_data));
  CONSTX #(.size(10), .\const (410)) inst390 (.data(inst390_data));
  CONSTX #(.size(10), .\const (80)) inst368 (.data(inst368_data));
  CONSTX #(.size(10), .\const (100)) inst369 (.data(inst369_data));
  CONSTX #(.size(10), .\const (398)) inst393 (.data(inst393_data));
  CONSTX #(.size(10), .\const (402)) inst394 (.data(inst394_data));
  CONSTX #(.size(10), .\const (99)) inst370 (.data(inst370_data));
  CONSTX #(.size(10), .\const (104)) inst371 (.data(inst371_data));
  CONSTX #(.size(10), .\const (398)) inst337 (.data(inst337_data));
  CONSTX #(.size(10), .\const (402)) inst338 (.data(inst338_data));
  CONSTX #(.size(10), .\const (169)) inst339 (.data(inst339_data));
  CONSTX #(.size(10), .\const (174)) inst340 (.data(inst340_data));
  or inst503 (kraj, inst238_out, inst239_out, inst241_out, inst240_out);
  CONSTX #(.size(10), .\const (390)) inst333 (.data(inst333_data));
  CONSTX #(.size(10), .\const (410)) inst334 (.data(inst334_data));
  CONSTX #(.size(10), .\const (150)) inst335 (.data(inst335_data));
  CONSTX #(.size(10), .\const (170)) inst336 (.data(inst336_data));
  CONSTX #(.size(10), .\const (390)) inst434 (.data(inst434_data));
  CONSTX #(.size(10), .\const (410)) inst435 (.data(inst435_data));
  CONSTX #(.size(10), .\const (220)) inst415 (.data(inst415_data));
  CONSTX #(.size(10), .\const (240)) inst416 (.data(inst416_data));
  CONSTX #(.size(10), .\const (398)) inst438 (.data(inst438_data));
  CONSTX #(.size(10), .\const (402)) inst439 (.data(inst439_data));
  CONSTX #(.size(10), .\const (239)) inst417 (.data(inst417_data));
  CONSTX #(.size(10), .\const (244)) inst421 (.data(inst421_data));
  CONSTX #(.size(10), .\const (390)) inst490 (.data(inst490_data));
  CONSTX #(.size(10), .\const (410)) inst491 (.data(inst491_data));
  CONSTX #(.size(10), .\const (290)) inst474 (.data(inst474_data));
  CONSTX #(.size(10), .\const (310)) inst475 (.data(inst475_data));
  CONSTX #(.size(10), .\const (398)) inst494 (.data(inst494_data));
  CONSTX #(.size(10), .\const (402)) inst495 (.data(inst495_data));
  CONSTX #(.size(10), .\const (309)) inst476 (.data(inst476_data));
  CONSTX #(.size(10), .\const (314)) inst477 (.data(inst477_data));
  xor inst519 (inst519_out, kraj, led3);
  DFF inst518 (.CLK(clk), .D(inst519_out), .Q(led3));  // open: CLRN, PRN
  or inst465 (inst465_out, c16, c17, c18, c19, c20);
  enemy inst457 (
    .clk(clk), .X(X), .Y(Y), .left(inst389_data), .right(inst390_data), .up(inst368_data),
    .down(inst369_data), .ld(ld), .top_left(inst393_data), .top_right(inst394_data), .top_up(inst370_data),
    .top_down(inst371_data), .mozelevo(X_1bit), .mozedesno(Y_1bit), .idides(z), .mojmetakup(metakup),
    .mojmetakleft(metakleft), .mojmetakright(metakright), .pucaj(u8), .playerup(xu), .playerleft(xl),
    .playerright(xd), .enemy(enemy3), .ididesno(ididesno3), .a(a3), .b(b3), .top(top3), .metak(metak3),
    .desilasekolizija(c3), .unisten(u3), .zavrsio_se_pucanj(z3), .gameover(go3));  // open: idilevo, enemy_left, enemy_right, enemy_up, enemy_down, metak_left, metak_right, metak_up, metak_down
  enemy inst462 (
    .clk(clk), .X(X), .Y(Y), .left(inst333_data), .right(inst334_data), .up(inst335_data),
    .down(inst336_data), .ld(ld), .top_left(inst337_data), .top_right(inst338_data), .top_up(inst339_data),
    .top_down(inst340_data), .mozelevo(X_1bit), .mozedesno(Y_1bit), .idides(z), .mojmetakup(metakup),
    .mojmetakleft(metakleft), .mojmetakright(metakright), .pucaj(u13), .playerup(xu), .playerleft(xl),
    .playerright(xd), .enemy(enemy8), .ididesno(ididesno8), .a(a8), .b(b8), .top(top8), .metak(metak8),
    .desilasekolizija(c8), .unisten(u8), .zavrsio_se_pucanj(z8), .gameover(go8));  // open: idilevo, enemy_left, enemy_right, enemy_up, enemy_down, metak_left, metak_right, metak_up, metak_down
  or inst402 (inst402_out, c1, c2, c3, c4, c5);
  or inst361 (inst361_out, c6, c7, c8, c9, c10);
  or inst508 (inst508_out, c11, c12, c13, c14, c15);
  enemy inst468 (
    .clk(clk), .X(X), .Y(Y), .left(inst434_data), .right(inst435_data), .up(inst415_data),
    .down(inst416_data), .ld(ld), .top_left(inst438_data), .top_right(inst439_data), .top_up(inst417_data),
    .top_down(inst421_data), .mozelevo(X_1bit), .mozedesno(Y_1bit), .idides(z), .mojmetakup(metakup),
    .mojmetakleft(metakleft), .mojmetakright(metakright), .pucaj(u18), .playerup(xu), .playerleft(xl),
    .playerright(xd), .enemy(enemy13), .ididesno(ididesno13), .a(a13), .b(b13), .top(top13), .metak(metak13),
    .desilasekolizija(c13), .unisten(u13), .zavrsio_se_pucanj(z13), .gameover(go13));  // open: idilevo, enemy_left, enemy_right, enemy_up, enemy_down, metak_left, metak_right, metak_up, metak_down
  enemy inst500 (
    .clk(clk), .X(X), .Y(Y), .left(inst490_data), .right(inst491_data), .up(inst474_data),
    .down(inst475_data), .ld(ld), .top_left(inst494_data), .top_right(inst495_data), .top_up(inst476_data),
    .top_down(inst477_data), .mozelevo(X_1bit), .mozedesno(Y_1bit), .idides(z), .mojmetakup(metakup),
    .mojmetakleft(metakleft), .mojmetakright(metakright), .playerup(xu), .playerleft(xl), .playerright(xd),
    .enemy(enemy18), .ididesno(ididesno18), .a(a18), .b(b18), .top(top18), .metak(metak18),
    .desilasekolizija(c18), .unisten(u18), .zavrsio_se_pucanj(z18), .gameover(go18));  // open: pucaj, idilevo, enemy_left, enemy_right, enemy_up, enemy_down, metak_left, metak_right, metak_up, metak_down
  or inst509 (t, inst402_out, inst361_out, inst508_out, inst465_out);
  or inst418 (inst418_out, a1, a2, a3, a4, a5);
  or inst382 (inst382_out, a9, a6, a7, a8, a10);
  or inst510 (inst510_out, a11, a12, a13, a14, a15);
  or inst405 (inst405_out, a16, a17, a18, a19, a20);
  CONSTX #(.size(10), .\const (510)) inst391 (.data(inst391_data));
  CONSTX #(.size(10), .\const (530)) inst392 (.data(inst392_data));
  CONSTX #(.size(10), .\const (80)) inst364 (.data(inst364_data));
  CONSTX #(.size(10), .\const (100)) inst365 (.data(inst365_data));
  CONSTX #(.size(10), .\const (518)) inst395 (.data(inst395_data));
  CONSTX #(.size(10), .\const (522)) inst396 (.data(inst396_data));
  CONSTX #(.size(10), .\const (99)) inst366 (.data(inst366_data));
  CONSTX #(.size(10), .\const (104)) inst367 (.data(inst367_data));
  CONSTX #(.size(10), .\const (510)) inst324 (.data(inst324_data));
  CONSTX #(.size(10), .\const (530)) inst325 (.data(inst325_data));
  CONSTX #(.size(10), .\const (150)) inst326 (.data(inst326_data));
  CONSTX #(.size(10), .\const (170)) inst327 (.data(inst327_data));
  CONSTX #(.size(10), .\const (518)) inst328 (.data(inst328_data));
  CONSTX #(.size(10), .\const (522)) inst329 (.data(inst329_data));
  CONSTX #(.size(10), .\const (169)) inst330 (.data(inst330_data));
  CONSTX #(.size(10), .\const (174)) inst331 (.data(inst331_data));
  CONSTX #(.size(10), .\const (518)) inst440 (.data(inst440_data));
  CONSTX #(.size(10), .\const (522)) inst441 (.data(inst441_data));
  CONSTX #(.size(10), .\const (239)) inst413 (.data(inst413_data));
  CONSTX #(.size(10), .\const (244)) inst414 (.data(inst414_data));
  CONSTX #(.size(10), .\const (510)) inst436 (.data(inst436_data));
  CONSTX #(.size(10), .\const (530)) inst437 (.data(inst437_data));
  CONSTX #(.size(10), .\const (220)) inst411 (.data(inst411_data));
  CONSTX #(.size(10), .\const (240)) inst412 (.data(inst412_data));
  CONSTX #(.size(10), .\const (510)) inst492 (.data(inst492_data));
  CONSTX #(.size(10), .\const (530)) inst493 (.data(inst493_data));
  CONSTX #(.size(10), .\const (290)) inst454 (.data(inst454_data));
  CONSTX #(.size(10), .\const (310)) inst471 (.data(inst471_data));
  CONSTX #(.size(10), .\const (518)) inst496 (.data(inst496_data));
  CONSTX #(.size(10), .\const (522)) inst497 (.data(inst497_data));
  CONSTX #(.size(10), .\const (309)) inst472 (.data(inst472_data));
  CONSTX #(.size(10), .\const (314)) inst473 (.data(inst473_data));
  or inst511 (X_1bit, inst418_out, inst382_out, inst510_out, inst405_out);
  enemy inst458 (
    .clk(clk), .X(X), .Y(Y), .left(inst391_data), .right(inst392_data), .up(inst364_data),
    .down(inst365_data), .ld(ld), .top_left(inst395_data), .top_right(inst396_data), .top_up(inst366_data),
    .top_down(inst367_data), .mozelevo(X_1bit), .mozedesno(Y_1bit), .idides(z), .mojmetakup(metakup),
    .mojmetakleft(metakleft), .mojmetakright(metakright), .pucaj(u9), .playerup(xu), .playerleft(xl),
    .playerright(xd), .enemy(enemy4), .ididesno(ididesno4), .a(a4), .b(b4), .top(top4), .metak(metak4),
    .desilasekolizija(c4), .unisten(u4), .zavrsio_se_pucanj(z4), .gameover(go4));  // open: idilevo, enemy_left, enemy_right, enemy_up, enemy_down, metak_left, metak_right, metak_up, metak_down
  enemy inst461 (
    .clk(clk), .X(X), .Y(Y), .left(inst324_data), .right(inst325_data), .up(inst326_data),
    .down(inst327_data), .ld(ld), .top_left(inst328_data), .top_right(inst329_data), .top_up(inst330_data),
    .top_down(inst331_data), .mozelevo(X_1bit), .mozedesno(Y_1bit), .idides(z), .mojmetakup(metakup),
    .mojmetakleft(metakleft), .mojmetakright(metakright), .pucaj(u14), .playerup(xu), .playerleft(xl),
    .playerright(xd), .enemy(enemy9), .ididesno(ididesno9), .a(a9), .b(b9), .top(top9), .metak(metak9),
    .desilasekolizija(c9), .unisten(u9), .zavrsio_se_pucanj(z9), .gameover(go9));  // open: idilevo, enemy_left, enemy_right, enemy_up, enemy_down, metak_left, metak_right, metak_up, metak_down
  enemy inst467 (
    .clk(clk), .X(X), .Y(Y), .left(inst436_data), .right(inst437_data), .up(inst411_data),
    .down(inst412_data), .ld(ld), .top_left(inst440_data), .top_right(inst441_data), .top_up(inst413_data),
    .top_down(inst414_data), .mozelevo(X_1bit), .mozedesno(Y_1bit), .idides(z), .mojmetakup(metakup),
    .mojmetakleft(metakleft), .mojmetakright(metakright), .pucaj(u19), .playerup(xu), .playerleft(xl),
    .playerright(xd), .enemy(enemy14), .ididesno(ididesno14), .a(a14), .b(b14), .top(top14), .metak(metak14),
    .desilasekolizija(c14), .unisten(u14), .zavrsio_se_pucanj(z14), .gameover(go14));  // open: idilevo, enemy_left, enemy_right, enemy_up, enemy_down, metak_left, metak_right, metak_up, metak_down
  enemy inst499 (
    .clk(clk), .X(X), .Y(Y), .left(inst492_data), .right(inst493_data), .up(inst454_data),
    .down(inst471_data), .ld(ld), .top_left(inst496_data), .top_right(inst497_data), .top_up(inst472_data),
    .top_down(inst473_data), .mozelevo(X_1bit), .mozedesno(Y_1bit), .idides(z), .mojmetakup(metakup),
    .mojmetakleft(metakleft), .mojmetakright(metakright), .playerup(xu), .playerleft(xl), .playerright(xd),
    .enemy(enemy19), .ididesno(ididesno19), .a(a19), .b(b19), .top(top19), .metak(metak19),
    .desilasekolizija(c19), .unisten(u19), .zavrsio_se_pucanj(z19), .gameover(go19));  // open: pucaj, idilevo, enemy_left, enemy_right, enemy_up, enemy_down, metak_left, metak_right, metak_up, metak_down
  or inst362 (inst362_out, b6, b7, b8, b9, b10);
  or inst403 (inst403_out, b1, b2, b3, b4, b5);
  or inst407 (inst407_out, b16, b17, b19, b18, b20);
  or inst419 (inst419_out, b11, b12, b13, b14, b15);
  CONSTX #(.size(10), .\const (638)) inst383 (.data(inst383_data));
  CONSTX #(.size(10), .\const (642)) inst386 (.data(inst386_data));
  CONSTX #(.size(10), .\const (99)) inst374 (.data(inst374_data));
  CONSTX #(.size(10), .\const (104)) inst375 (.data(inst375_data));
  or inst512 (Y_1bit, inst362_out, inst403_out, inst407_out, inst419_out);
  CONSTX #(.size(10), .\const (630)) inst380 (.data(inst380_data));
  CONSTX #(.size(10), .\const (650)) inst381 (.data(inst381_data));
  CONSTX #(.size(10), .\const (80)) inst372 (.data(inst372_data));
  CONSTX #(.size(10), .\const (100)) inst373 (.data(inst373_data));
  CONSTX #(.size(10), .\const (630)) inst342 (.data(inst342_data));
  CONSTX #(.size(10), .\const (650)) inst343 (.data(inst343_data));
  CONSTX #(.size(10), .\const (150)) inst344 (.data(inst344_data));
  CONSTX #(.size(10), .\const (170)) inst345 (.data(inst345_data));
  CONSTX #(.size(10), .\const (638)) inst346 (.data(inst346_data));
  CONSTX #(.size(10), .\const (642)) inst347 (.data(inst347_data));
  CONSTX #(.size(10), .\const (169)) inst348 (.data(inst348_data));
  CONSTX #(.size(10), .\const (174)) inst349 (.data(inst349_data));
  CONSTX #(.size(10), .\const (630)) inst430 (.data(inst430_data));
  CONSTX #(.size(10), .\const (650)) inst431 (.data(inst431_data));
  CONSTX #(.size(10), .\const (220)) inst422 (.data(inst422_data));
  CONSTX #(.size(10), .\const (240)) inst423 (.data(inst423_data));
  CONSTX #(.size(10), .\const (638)) inst432 (.data(inst432_data));
  CONSTX #(.size(10), .\const (642)) inst433 (.data(inst433_data));
  CONSTX #(.size(10), .\const (239)) inst424 (.data(inst424_data));
  CONSTX #(.size(10), .\const (244)) inst425 (.data(inst425_data));
  CONSTX #(.size(10), .\const (638)) inst488 (.data(inst488_data));
  CONSTX #(.size(10), .\const (642)) inst489 (.data(inst489_data));
  CONSTX #(.size(10), .\const (309)) inst480 (.data(inst480_data));
  CONSTX #(.size(10), .\const (314)) inst481 (.data(inst481_data));
  CONSTX #(.size(10), .\const (630)) inst486 (.data(inst486_data));
  CONSTX #(.size(10), .\const (650)) inst487 (.data(inst487_data));
  CONSTX #(.size(10), .\const (290)) inst478 (.data(inst478_data));
  CONSTX #(.size(10), .\const (310)) inst479 (.data(inst479_data));
  enemy inst459 (
    .clk(clk), .X(X), .Y(Y), .left(inst380_data), .right(inst381_data), .up(inst372_data),
    .down(inst373_data), .ld(ld), .top_left(inst383_data), .top_right(inst386_data), .top_up(inst374_data),
    .top_down(inst375_data), .mozelevo(X_1bit), .mozedesno(Y_1bit), .idides(z), .mojmetakup(metakup),
    .mojmetakleft(metakleft), .mojmetakright(metakright), .pucaj(u10), .playerup(xu), .playerleft(xl),
    .playerright(xd), .enemy(enemy5), .ididesno(ididesno5), .a(a5), .b(b5), .top(top5), .metak(metak5),
    .desilasekolizija(c5), .unisten(u5), .zavrsio_se_pucanj(z5), .gameover(go5));  // open: idilevo, enemy_left, enemy_right, enemy_up, enemy_down, metak_left, metak_right, metak_up, metak_down
  enemy inst460 (
    .clk(clk), .X(X), .Y(Y), .left(inst342_data), .right(inst343_data), .up(inst344_data),
    .down(inst345_data), .ld(ld), .top_left(inst346_data), .top_right(inst347_data), .top_up(inst348_data),
    .top_down(inst349_data), .mozelevo(X_1bit), .mozedesno(Y_1bit), .idides(z), .mojmetakup(metakup),
    .mojmetakleft(metakleft), .mojmetakright(metakright), .pucaj(u15), .playerup(xu), .playerleft(xl),
    .playerright(xd), .enemy(enemy10), .ididesno(ididesno10), .a(a10), .b(b10), .top(top10), .metak(metak10),
    .desilasekolizija(c10), .unisten(u10), .zavrsio_se_pucanj(z10), .gameover(go10));  // open: idilevo, enemy_left, enemy_right, enemy_up, enemy_down, metak_left, metak_right, metak_up, metak_down
  enemy inst466 (
    .clk(clk), .X(X), .Y(Y), .left(inst430_data), .right(inst431_data), .up(inst422_data),
    .down(inst423_data), .ld(ld), .top_left(inst432_data), .top_right(inst433_data), .top_up(inst424_data),
    .top_down(inst425_data), .mozelevo(X_1bit), .mozedesno(Y_1bit), .idides(z), .mojmetakup(metakup),
    .mojmetakleft(metakleft), .mojmetakright(metakright), .pucaj(u20), .playerup(xu), .playerleft(xl),
    .playerright(xd), .enemy(enemy15), .ididesno(ididesno15), .a(a15), .b(b15), .top(top15), .metak(metak15),
    .desilasekolizija(c15), .unisten(u15), .zavrsio_se_pucanj(z15), .gameover(go15));  // open: idilevo, enemy_left, enemy_right, enemy_up, enemy_down, metak_left, metak_right, metak_up, metak_down
  enemy inst498 (
    .clk(clk), .X(X), .Y(Y), .left(inst486_data), .right(inst487_data), .up(inst478_data),
    .down(inst479_data), .ld(ld), .top_left(inst488_data), .top_right(inst489_data), .top_up(inst480_data),
    .top_down(inst481_data), .mozelevo(X_1bit), .mozedesno(Y_1bit), .idides(z), .mojmetakup(metakup),
    .mojmetakleft(metakleft), .mojmetakright(metakright), .playerup(xu), .playerleft(xl), .playerright(xd),
    .enemy(enemy20), .ididesno(ididesno20), .a(a20), .b(b20), .top(top20), .metak(metak20),
    .desilasekolizija(c20), .unisten(u20), .zavrsio_se_pucanj(z20), .gameover(go20));  // open: pucaj, idilevo, enemy_left, enemy_right, enemy_up, enemy_down, metak_left, metak_right, metak_up, metak_down
  or inst363 (inst363_out, ididesno6, ididesno7, ididesno8, ididesno9, ididesno10);
  or inst404 (inst404_out, ididesno1, ididesno2, ididesno3, ididesno4, ididesno5);
  or inst406 (inst406_out, ididesno11, ididesno12, ididesno13, ididesno14, ididesno15);
  or inst514 (inst514_out, ididesno16, ididesno17, ididesno18, ididesno19, ididesno20);
  or inst513 (z, inst363_out, inst404_out, inst406_out, inst514_out);

  // Other names for the same wires on the sheet: over = led3

  // Notes on the sheet:
  //   X osa igraca
  //   Y osa igraca
  //   X osa topa
  //   Y osa topa
  //   Ivice ekrana
  //   X osa metka
  //   Y osa metka
endmodule
